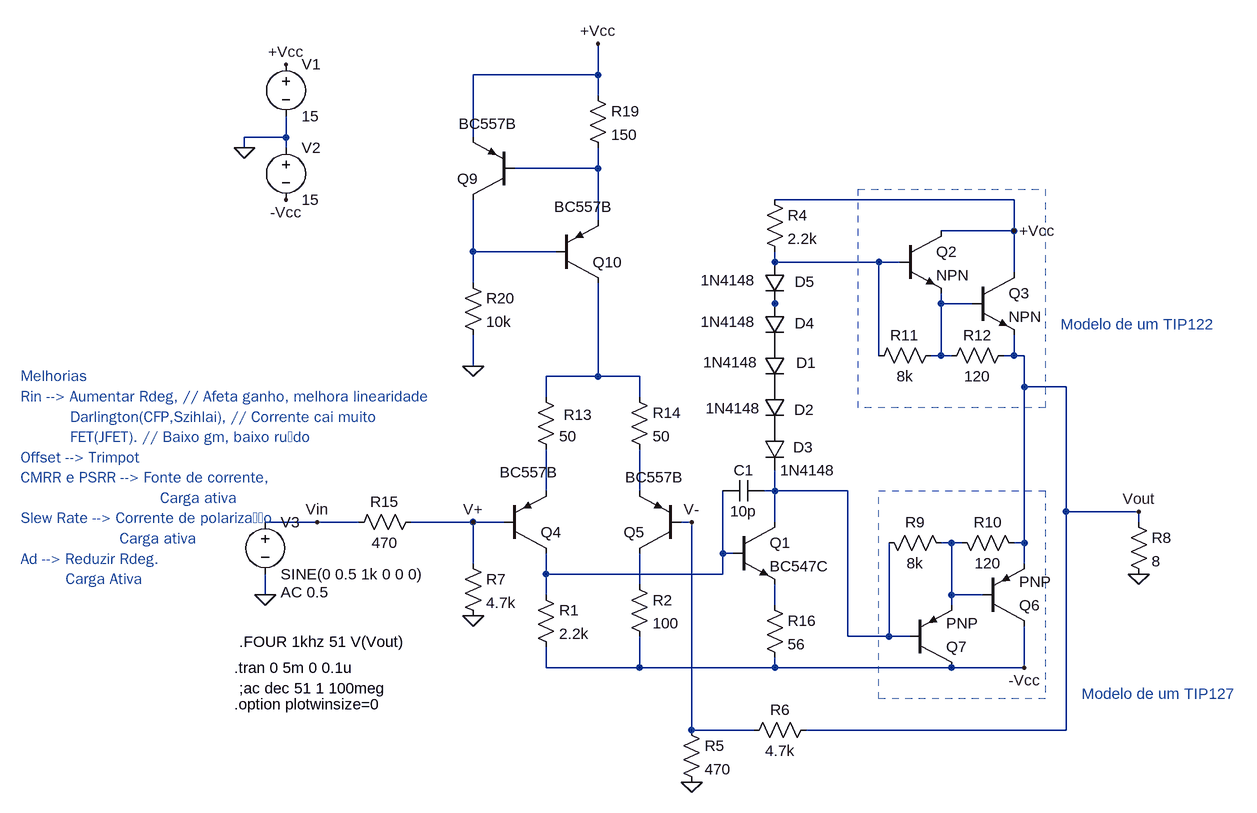
[diagram p0: schematic Circuito.asc]
Circuito.asc, the LTspice schematic file:
Version 4
SHEET 1 2224 680
WIRE 48 -528 48 -576
WIRE 48 -528 -144 -528
WIRE 48 -496 48 -528
WIRE -432 -432 -432 -464
WIRE -432 -432 -496 -432
WIRE -144 -432 -144 -528
WIRE -496 -416 -496 -432
WIRE -432 -416 -432 -432
WIRE 48 -384 48 -416
WIRE 48 -384 -80 -384
WIRE 688 -336 320 -336
WIRE 48 -304 48 -384
WIRE 688 -288 688 -336
WIRE 688 -288 576 -288
WIRE -144 -256 -144 -336
WIRE -16 -256 -144 -256
WIRE 320 -240 320 -256
WIRE 480 -240 320 -240
WIRE 512 -240 480 -240
WIRE 688 -224 688 -288
WIRE -144 -208 -144 -256
WIRE 320 -176 320 -192
WIRE 576 -176 576 -192
WIRE 624 -176 576 -176
WIRE 480 -96 480 -240
WIRE 576 -96 576 -176
WIRE 576 -96 560 -96
WIRE 592 -96 576 -96
WIRE 688 -96 688 -128
WIRE 688 -96 672 -96
WIRE 704 -96 688 -96
WIRE -144 -80 -144 -128
WIRE 48 -64 48 -208
WIRE 48 -64 -32 -64
WIRE 112 -64 48 -64
WIRE 704 -48 704 -96
WIRE 768 -48 704 -48
WIRE -32 -32 -32 -64
WIRE 112 -32 112 -64
WIRE -32 112 -32 48
WIRE 112 112 112 48
WIRE 320 112 320 80
WIRE 320 112 304 112
WIRE 432 112 320 112
WIRE 768 144 768 -48
WIRE 880 144 768 144
WIRE -384 160 -464 160
WIRE -320 160 -384 160
WIRE -144 160 -240 160
WIRE -96 160 -144 160
WIRE 192 160 176 160
WIRE 320 160 320 112
WIRE 880 160 880 144
WIRE 592 192 576 192
WIRE 608 192 592 192
WIRE 704 192 704 -48
WIRE 704 192 688 192
WIRE 240 208 240 112
WIRE 256 208 240 208
WIRE -144 224 -144 160
WIRE 704 224 704 192
WIRE -32 240 -32 208
WIRE 240 240 240 208
WIRE 240 240 -32 240
WIRE 112 256 112 208
WIRE -464 272 -464 240
WIRE -32 272 -32 240
WIRE 592 272 592 192
WIRE 640 272 592 272
WIRE 320 288 320 256
WIRE 592 288 592 272
WIRE 432 336 432 112
WIRE 496 336 496 192
WIRE 496 336 432 336
WIRE 528 336 496 336
WIRE -32 384 -32 352
WIRE 112 384 112 336
WIRE 112 384 -32 384
WIRE 320 384 320 368
WIRE 320 384 112 384
WIRE 592 384 320 384
WIRE 704 384 704 320
WIRE 704 384 592 384
WIRE 192 480 192 160
WIRE 288 480 192 480
WIRE 768 480 768 144
WIRE 768 480 368 480
FLAG -464 272 0
FLAG -496 -416 0
FLAG -432 -544 +Vcc
FLAG 688 -288 +Vcc
FLAG -432 -336 -Vcc
FLAG 704 384 -Vcc
FLAG 880 240 0
FLAG 192 560 0
FLAG 880 144 Vout
FLAG -144 304 0
FLAG 48 -576 +Vcc
FLAG -144 -80 0
FLAG -144 160 V+
FLAG 192 160 V-
FLAG -384 160 Vin
SYMBOL pnp -96 208 M180
WINDOW 3 -7 125 Left 2
SYMATTR Value BC557B
SYMATTR InstName Q4
SYMBOL pnp 176 208 R180
WINDOW 3 -3 117 Left 2
SYMATTR Value BC557B
SYMATTR InstName Q5
SYMBOL res -48 256 R0
SYMATTR InstName R1
SYMATTR Value 2.2k
SYMBOL res 304 -352 R0
SYMATTR InstName R4
SYMATTR Value 2.2k
SYMBOL res 176 464 R0
SYMATTR InstName R5
SYMATTR Value 470
SYMBOL voltage -432 -560 R0
WINDOW 123 0 0 Left 2
WINDOW 39 0 0 Left 2
SYMATTR InstName V1
SYMATTR Value 15
SYMBOL voltage -432 -432 R0
WINDOW 123 0 0 Left 2
WINDOW 39 0 0 Left 2
SYMATTR InstName V2
SYMATTR Value 15
SYMBOL res 96 240 R0
SYMATTR InstName R2
SYMATTR Value 100
SYMBOL voltage -464 144 R0
WINDOW 123 24 124 Left 2
WINDOW 39 24 152 Left 2
SYMATTR Value2 AC 0.5
SYMATTR InstName V3
SYMATTR Value SINE(0 0.5 1k 0 0 0)
SYMBOL res 864 144 R0
SYMATTR InstName R8
SYMATTR Value 8
SYMBOL res 384 464 R90
WINDOW 0 0 56 VBottom 2
WINDOW 3 32 56 VTop 2
SYMATTR InstName R6
SYMATTR Value 4.7k
SYMBOL res 480 176 M90
WINDOW 0 0 56 VBottom 2
WINDOW 3 32 56 VTop 2
SYMATTR InstName R9
SYMATTR Value 8k
SYMBOL res 592 176 M90
WINDOW 0 0 56 VBottom 2
WINDOW 3 32 56 VTop 2
SYMATTR InstName R10
SYMATTR Value 120
SYMBOL npn 512 -288 R0
SYMATTR InstName Q2
SYMBOL npn 624 -224 R0
SYMATTR InstName Q3
SYMBOL res 464 -80 R270
WINDOW 0 32 56 VTop 2
WINDOW 3 0 56 VBottom 2
SYMATTR InstName R11
SYMATTR Value 8k
SYMBOL res 576 -80 R270
WINDOW 0 32 56 VTop 2
WINDOW 3 0 56 VBottom 2
SYMATTR InstName R12
SYMATTR Value 120
SYMBOL pnp 640 320 M180
SYMATTR InstName Q6
SYMBOL pnp 528 384 M180
SYMATTR InstName Q7
SYMBOL npn 256 160 R0
SYMATTR InstName Q1
SYMATTR Value BC547C
SYMBOL cap 304 96 R90
WINDOW 0 0 32 VBottom 2
WINDOW 3 32 32 VTop 2
SYMATTR InstName C1
SYMATTR Value 10p
SYMBOL diode 304 -112 R0
WINDOW 0 49 27 Left 2
WINDOW 3 -94 26 Left 2
SYMATTR InstName D1
SYMATTR Value 1N4148
SYMBOL diode 304 -48 R0
WINDOW 0 46 35 Left 2
WINDOW 3 -90 33 Left 2
SYMATTR InstName D2
SYMATTR Value 1N4148
SYMBOL diode 304 16 R0
WINDOW 0 44 29 Left 2
SYMATTR InstName D3
SYMATTR Value 1N4148
SYMBOL diode 304 -176 R0
WINDOW 0 47 30 Left 2
WINDOW 3 -98 28 Left 2
SYMATTR InstName D4
SYMATTR Value 1N4148
SYMBOL res -160 208 R0
SYMATTR InstName R7
SYMATTR Value 4.7k
SYMBOL diode 304 -240 R0
WINDOW 0 47 30 Left 2
WINDOW 3 -98 28 Left 2
SYMATTR InstName D5
SYMATTR Value 1N4148
SYMBOL res -48 -48 R0
WINDOW 0 43 43 Left 2
SYMATTR InstName R13
SYMATTR Value 50
SYMBOL res 96 -48 R0
SYMATTR InstName R14
SYMATTR Value 50
SYMBOL res -224 144 R90
WINDOW 0 0 56 VBottom 2
WINDOW 3 32 56 VTop 2
SYMATTR InstName R15
SYMATTR Value 470
SYMBOL res 304 272 R0
SYMATTR InstName R16
SYMATTR Value 56
SYMBOL pnp -80 -336 R180
WINDOW 3 -3 117 Left 2
SYMATTR Value BC557B
SYMATTR InstName Q9
SYMBOL pnp -16 -208 M180
WINDOW 3 -3 117 Left 2
SYMATTR Value BC557B
SYMATTR InstName Q10
SYMBOL res 32 -512 R0
SYMATTR InstName R19
SYMATTR Value 150
SYMBOL res -160 -224 R0
SYMATTR InstName R20
SYMATTR Value 10k
TEXT -512 384 Left 2 !.tran 0 5m 0 0.1u
TEXT -504 344 Left 2 !.FOUR 1khz 51 V(Vout)
TEXT 760 -144 Left 2 ;Modelo de um TIP122
TEXT 792 424 Left 2 ;Modelo de um TIP127
TEXT -504 416 Left 2 !;ac dec 51 1 100meg
TEXT -512 440 Left 2 !.option plotwinsize=0
TEXT -840 -64 Left 2 ;Melhorias\nRin --> Aumentar Rdeg, // Afeta ganho, melhora linearidade\n           Darlington(CFP,Szihlai), // Corrente cai muito\n           FET(JFET). // Baixo gm, baixo ru�do\nOffset --> Trimpot\nCMRR e PSRR --> Fonte de corrente,\n                               Carga ativa\nSlew Rate --> Corrente de polariza��o\n                      Carga ativa\nAd --> Reduzir Rdeg.\n          Carga Ativa
RECTANGLE Normal 736 -16 448 -352 2
RECTANGLE Normal 736 432 480 112 2

The netlist it stands for:
* Circuito.asc
Q4 N011 V+ N007 0 BC557B
Q5 N012 V- N008 0 BC557B
R1 N011 -Vcc 2.2k
R4 +Vcc N003 2.2k
R5 V- 0 470
V1 +Vcc 0 15
V2 0 -Vcc 15
R2 N012 -Vcc 100
V3 Vin 0 SINE(0 0.5 1k 0 0 0) AC 0.5
R8 Vout 0 8
R6 Vout V- 4.7k
R9 N009 N010 8k
R10 N010 Vout 120
Q2 +Vcc N003 N005 0 NPN
Q3 +Vcc N005 Vout 0 NPN
R11 N003 N005 8k
R12 N005 Vout 120
Q6 -Vcc N010 Vout 0 PNP
Q7 -Vcc N009 N010 0 PNP
Q1 N009 N011 N013 0 BC547C
C1 N009 N011 10p
D1 P001 P002 1N4148
D2 P002 P003 1N4148
D3 P003 N009 1N4148
D4 N004 P001 1N4148
R7 V+ 0 4.7k
D5 N003 N004 1N4148
R13 N006 N007 50
R14 N006 N008 50
R15 V+ Vin 470
R16 N013 -Vcc 56
Q9 N002 N001 +Vcc 0 BC557B
Q10 N006 N002 N001 0 BC557B
R19 +Vcc N001 150
R20 N002 0 10k
.model D D
.lib standard.dio
.model NPN NPN
.model PNP PNP
.lib standard.bjt
.tran 0 5m 0 0.1u
.FOUR 1khz 51 V(Vout)
* Modelo de um TIP122
* Modelo de um TIP127
;ac dec 51 1 100meg
.option plotwinsize=0
* Melhorias
* Rin --> Aumentar Rdeg, // Afeta ganho, melhora linearidade
*            Darlington(CFP,Szihlai), // Corrente cai muito
*            FET(JFET). // Baixo gm, baixo ru�do
* Offset --> Trimpot
* CMRR e PSRR --> Fonte de corrente,
*                                Carga ativa
* Slew Rate --> Corrente de polariza��o
*                       Carga ativa
* Ad --> Reduzir Rdeg.
*           Carga Ativa
.backanno
.end